# Altium schematic sheet ESP32.SchDoc
size A4; CompanyName: Hydriven; Organization: Hydriven; Revision: V1.1; SheetNumber: 10; SheetTotal: 10; Team: 2025; Subsystem: Embedded Systems
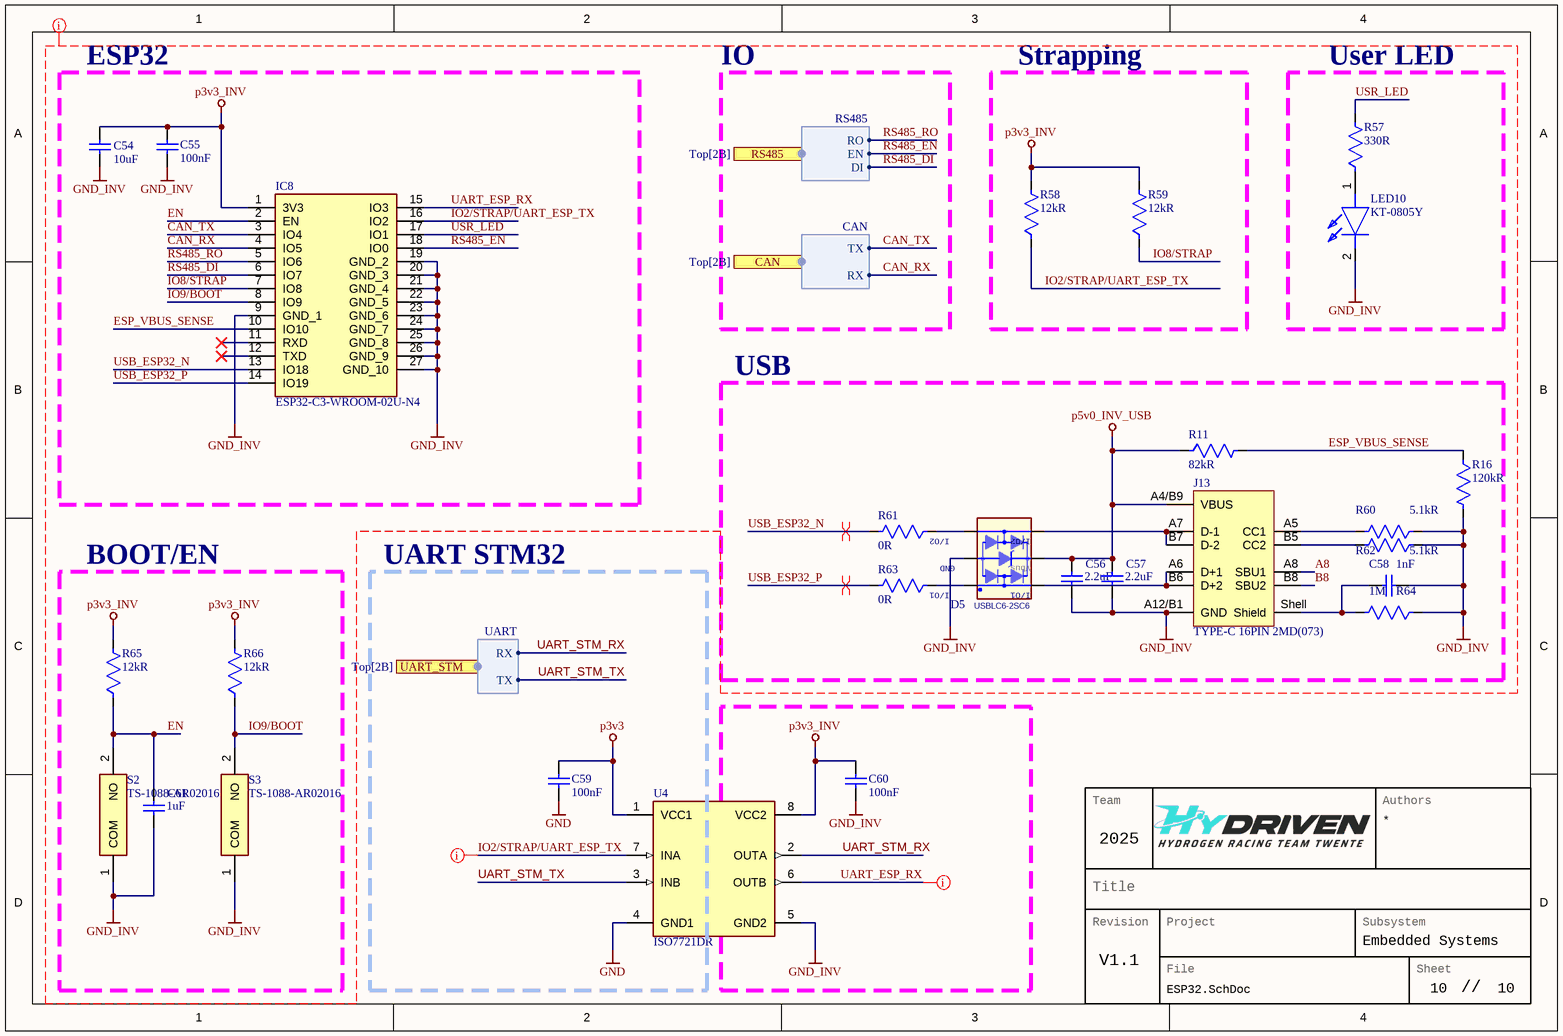
[diagram p0: ESP32.SchDoc]

## Parts
C54  value 10uF  [WCAP-CSGP_1206_L3.2W1.6H1.15]  (hidden comment: CAP 1206 10uF X7R)
C55  value 100nF  [WCAP-CSGP_0402_L1W0.5H0.5]  (hidden comment: CAP 0402 100nF X7R)
C56  value 2.2uF  [WCAP-CSGP_0603_L1.6W0.8H0.8_Reflow]  (hidden comment: CAP 0603 2.2uF X7R)
C57  value 2.2uF  [WCAP-CSGP_0603_L1.6W0.8H0.8_Reflow]  (hidden comment: CAP 0603 2.2uF X7R)
C58  value 1nF  [WCAP-CSGP_1206_L3.2W1.6H1.15]  (hidden comment: CAP 1206 1nF X7R)
C59  value 100nF  [WCAP-CSGP_0402_L1W0.5H0.5]  (hidden comment: CAP 0402 100nF X7R)
C60  value 100nF  [WCAP-CSGP_0402_L1W0.5H0.5]  (hidden comment: CAP 0402 100nF X7R)
C61  value 1uF  [WCAP-CSGP_0402_L1W0.5H0.5]  (hidden comment: CAP 0402 1uF X7R)
D5  USBLC6-2SC6  [ST_SOT23-6L]
IC8  ESP32-C3-WROOM-02U-N4  [ESP32C3WROOM02UN4]
J13  TYPE-C 16PIN 2MD(073)  [629722000214]
LED10  KT-0805Y  [KT0805G]
R11  value 82kR  [RES_SM0603_YAGEORC_N]  (hidden comment: RES 0603 82kR 1%)
R16  value 120kR  [RES_SM0603_YAGEORC_N]  (hidden comment: RES 0603 120kR 1%)
R57  value 330R  [RES_SM0603_YAGEORC_N]  (hidden comment: RES 0603 330R 1%)
R58  value 12kR  [FP0402]  (hidden comment: RES 0402 12kR 1%)
R59  value 12kR  [FP0402]  (hidden comment: RES 0402 12kR 1%)
R60  value 5.1kR  [FP0402]  (hidden comment: RES 0402 5.1kR 1%)
R61  value 0R  [FP0402]  (hidden comment: RES 0402 0R 1%)
R62  value 5.1kR  [FP0402]  (hidden comment: RES 0402 5.1kR 1%)
R63  value 0R  [FP0402]  (hidden comment: RES 0402 0R 1%)
R64  value 1M  [RES_SM1206_YAGEORC_N]  (hidden comment: RES 1206 1M 1%)
R65  value 12kR  [FP0402]  (hidden comment: RES 0402 12kR 1%)
R66  value 12kR  [FP0402]  (hidden comment: RES 0402 12kR 1%)
S2  TS-1088-AR02016  [TS1088AR02016]
S3  TS-1088-AR02016  [TS1088AR02016]
U4  ISO7721DR  [FP-D0008B-MFG]

## Blocks framed on the sheet
ESP32: C54 C55 IC8
Strapping: R58 R59
User LED: LED10 R57
USB: C56-C58 D5 J13 R11 R16 R60-R64
BOOT/EN: C61 R65 R66 S2 S3
UART STM32: C59

## Ports
CAN (out, harness CAN, see Top[2B]), RS485 (out, harness RS485, see Top[2B]), UART_STM (out, harness UART, see Top[2B])

## Harnesses
RS485: RO, EN, DI
CAN: RX, TX
UART: TX, RX

## Nets
GND: C59.1 U4.4(GND1)
GND_INV: C54.1 C55.2 C56.1 C57.1 C58.2 C60.1 C61.1 D5.2(GND) IC8.9(GND_1) IC8.19(GND_2) IC8.20(GND_3) IC8.21(GND_4) IC8.22(GND_5) IC8.23(GND_6) IC8.24(GND_7) IC8.25(GND_8) IC8.26(GND_9) IC8.27(GND_10) J13.A12/B1(GND) LED10.2(K) R16.2 R60.1 R62.1 R64.1 S2.1(COM) S3.1(COM) U4.5(GND2)
p3v3: C59.2 U4.1(VCC1)
p3v3_INV: C54.2 C55.1 C60.2 IC8.1(3V3) R58.2 R59.2 R65.2 R66.2 U4.8(VCC2)
p5v0_INV_USB: C56.2 C57.2 D5.5(Vbus) J13.A4/B9(VBUS) R11.1
A8: J13.A8(SBU1)
B8: J13.B8(SBU2)
CAN_RX: IC8.4(IO5) ; port CAN.RX
CAN_TX: IC8.3(IO4) ; port CAN.TX
EN: C61.2 IC8.2(EN) R65.1 S2.2(NO)
ESP_VBUS_SENSE: IC8.10(IO10) R11.2 R16.1
IO2/STRAP/UART_ESP_TX: IC8.16(IO2) R58.1 U4.7(INA)
IO8/STRAP: IC8.7(IO8) R59.1
IO9/BOOT: IC8.8(IO9) R66.1 S3.2(NO)
RS485_DI: IC8.6(IO7) ; port RS485.DI
RS485_EN: IC8.18(IO0) ; port RS485.EN
RS485_RO: IC8.5(IO6) ; port RS485.RO
UART_ESP_RX: IC8.15(IO3) U4.6(OUTB)
UART_STM_RX: U4.2(OUTA) ; port UART_STM.RX
UART_STM_TX: U4.3(INB) ; port UART_STM.TX
USB_ESP32_N: IC8.13(IO18) R61.2
USB_ESP32_P: IC8.14(IO19) R63.2
USR_LED: IC8.17(IO1) R57.2
NetC58_1: C58.1 J13.Shell(Shield) R64.2
NetD5_1: D5.1(I/O1) R63.1
NetD5_3: D5.3(I/O2) R61.1
NetD5_4: D5.4(I/O2+) J13.A7(D-1) J13.B7(D-2)
NetD5_6: D5.6(I/O1+) J13.A6(D+1) J13.B6(D+2)
NetJ13_A5: J13.A5(CC1) R60.2
NetJ13_B5: J13.B5(CC2) R62.2
NetLED10_1: LED10.1(A) R57.1

Not connected (* = marked no-connect by the designer): IC8 11(RXD)* 12(TXD)*

## Layout directives
differential pair; differential pair class USB90; rule Clearance Constraint [Generic clearance = 0.15mm, and 12 value(s) for objects]: USB_ESP32_N, USB_ESP32_P
net class INV: A8, B8, CAN_RX, CAN_TX, EN, ESP_VBUS_SENSE, GND_INV, IO2/STRAP/UART_ESP_TX, IO8/STRAP, IO9/BOOT, p3v3_INV, p5v0_INV_USB, RS485_DI, RS485_EN, RS485_RO, UART_ESP_RX, USB_ESP32_N, USB_ESP32_P, USR_LED

## Notes on the sheet
- IO
- Team
- Authors
- Revision
- Title
- Project
- Subsystem
- File
- Sheet
- //

## Library data of the parts
C54 = CMP-001-01311-1: GTT Standard 1206 non-polarized capacitor; Case/Package: 1206; Ceramic Type: X7R; Category: Multilayer Ceramic Chip Capacitors; Pins: 2; JLCPCB Part #: C13585
C55 C59-C61 = CMP-001-01308-5: GTT Standard 0402 non-polarized capacitor; Pins: 2; Case/Package: 0402; Category: Multilayer Ceramic Chip Capacitors; Ceramic Type: X7R
  C55: JLCPCB Part #: C1525
  C59 C60: ClassName: TPL_Trans; JLCPCB Part #: C1525
  C61: JLCPCB Part #: C52923
C56 C57 = CMP-001-01309-1: GTT Standard 0603 non-polarized capacitor; Case/Package: 0603; Category: Multilayer Ceramic Chip Capacitors; Ceramic Type: X7R; Pins: 2; JLCPCB Part #: C23630
C58 = CMP-001-01311-1: GTT Standard 1206 non-polarized capacitor; Voltage Rating: 2kV; Case/Package: 1206; Ceramic Type: X7R; Category: Multilayer Ceramic Chip Capacitors; Pins: 2; JLCPCB Part #: C9196
D5 = CMP-004-00059-1: Design Item ID: USBLC6-2SC6; Source: USBLC6-2SC6.SchLib
IC8 = ESP32-C3-WROOM-02U-N4: Integrated Circuit; Manufacturer_Name: Espressif Systems; Datasheet Link: https://www.espressif.com/sites/default/files/documentation/esp32-c3-wroom-02_datasheet_en.pdf; Height: 3.35mm; Manufacturer_Part_Number: ESP32-C3-WROOM-02U-N4; Mouser Part Number: 356-ESP32C3WROM02UN4; Mouser Price/Stock: https://www.mouser.co.uk/ProductDetail/Espressif-Systems/ESP32-C3-WROOM-02U-N4?qs=pBJMDPsKWf2Ces2aXBSNjQ%3D%3D
J13 = CMP-002-000088-9: WR-USB 2.0 Type C, Receptacle, Horizontal, SMT; pin to pad: A4/B9>A4/B9+A9/B4 A12/B1>A12/B1+A1/B12; Manufacturer: Wurth Elektronik; Number of Ports: 1; Interface Type: Type C; Working Voltage: 20VAC; Rated Current: 5A; ComponentLink1URL: https://www.we-online.com/redexpert/article/629722000214?ad; Number of Pins: 16; ComponentLink2Description: Datasheet Link; Component Type: Standard; Mount: Surface Mount; Manufacturer Part Number: 629722000214; Orientation: Horizontal; Design Item ID: 629722000214; Operating Temperature Max: 85°C; Packaging: Tape and Reel; Operating Temperature Min: -40°C; ComponentLink2URL: https://www.we-online.com/redexpert/spec/629722000214?ad; Pin Count: 13; Source: WR-USB.SchLib; Gender: Receptacle; Application: USB 2.0; Match Code: WR-USB; ComponentLink1Description: Website Link; Category: Input/Output Connectors
LED10 = KT-0805G: LED; Manufacturer_Name: Hubei KENTO Elec; Datasheet Link: https://jlcpcb.com/api/file/downloadByFileSystemAccessId/8639582106239348736; Height: 0.95mm; Manufacturer_Part_Number: KT-0805G; JLCPCB Part #: C2296
R11 R16 R57 = CMP-009-00206-3: GTT Standard 0603 Resistor; Voltage Rating: 50V; Power: 62.5mW; Case/Package: 0603; Tolerance: 1%; Mounting Technology: SMD
  R11: JLCPCB Part #: C23254
  R16: JLCPCB Part #: C25808
  R57: JLCPCB Part #: C23138
R58-R63 R65 R66 = CMP-009-00204-17: GTT Standard 0402 Resistor; Voltage Rating: 50V; Power: 62.5mW; Case/Package: 0402; Mounting Technology: SMD; Design Item ID: RES 0402; Source: Passives.SchLib; Tolerance: 1%
  R58 R59 R65 R66: JLCPCB Part #: C25752
  R60 R62: JLCPCB Part #: C25905
  R61 R63: JLCPCB Part #: C17168
R64 = CMP-009-00208-3: GTT Standard 1206 Resistor; Voltage Rating: 50V; Power: 62.5mW; Tolerance: 1%; Case/Package: 1206; Mounting Technology: SMD; JLCPCB Part #: C17927
S2 S3 = TS-1088-AR02016: Switch; Manufacturer_Name: XUNPU; Datasheet Link: https://www.xunpudianzi.com/uploads/pdf/TS-1088-ARXXX.pdf; Height: 2mm; Manufacturer_Part_Number: TS-1088-AR02016
U4 = CMP-04872-000019-2: DGTL ISO 3KV GEN PRP 8SOIC; Isolated Power: No; Channel Type: Unidirectional; Pulse Width Distortion (PWD): 4.9ns; Propagation Delay: 16ns; Number of Channels: 2; Data Rate: 100Mbps; Case/Package: SOIC; Number of Pins: 8; Min Operating Temperature: -55°C; Max Operating Temperature: 125°C; Type: General Purpose; Packaging: Tape and Reel; Mount: Surface Mount